# EAGLE design M452X3 (EAGLE 6.6.0)
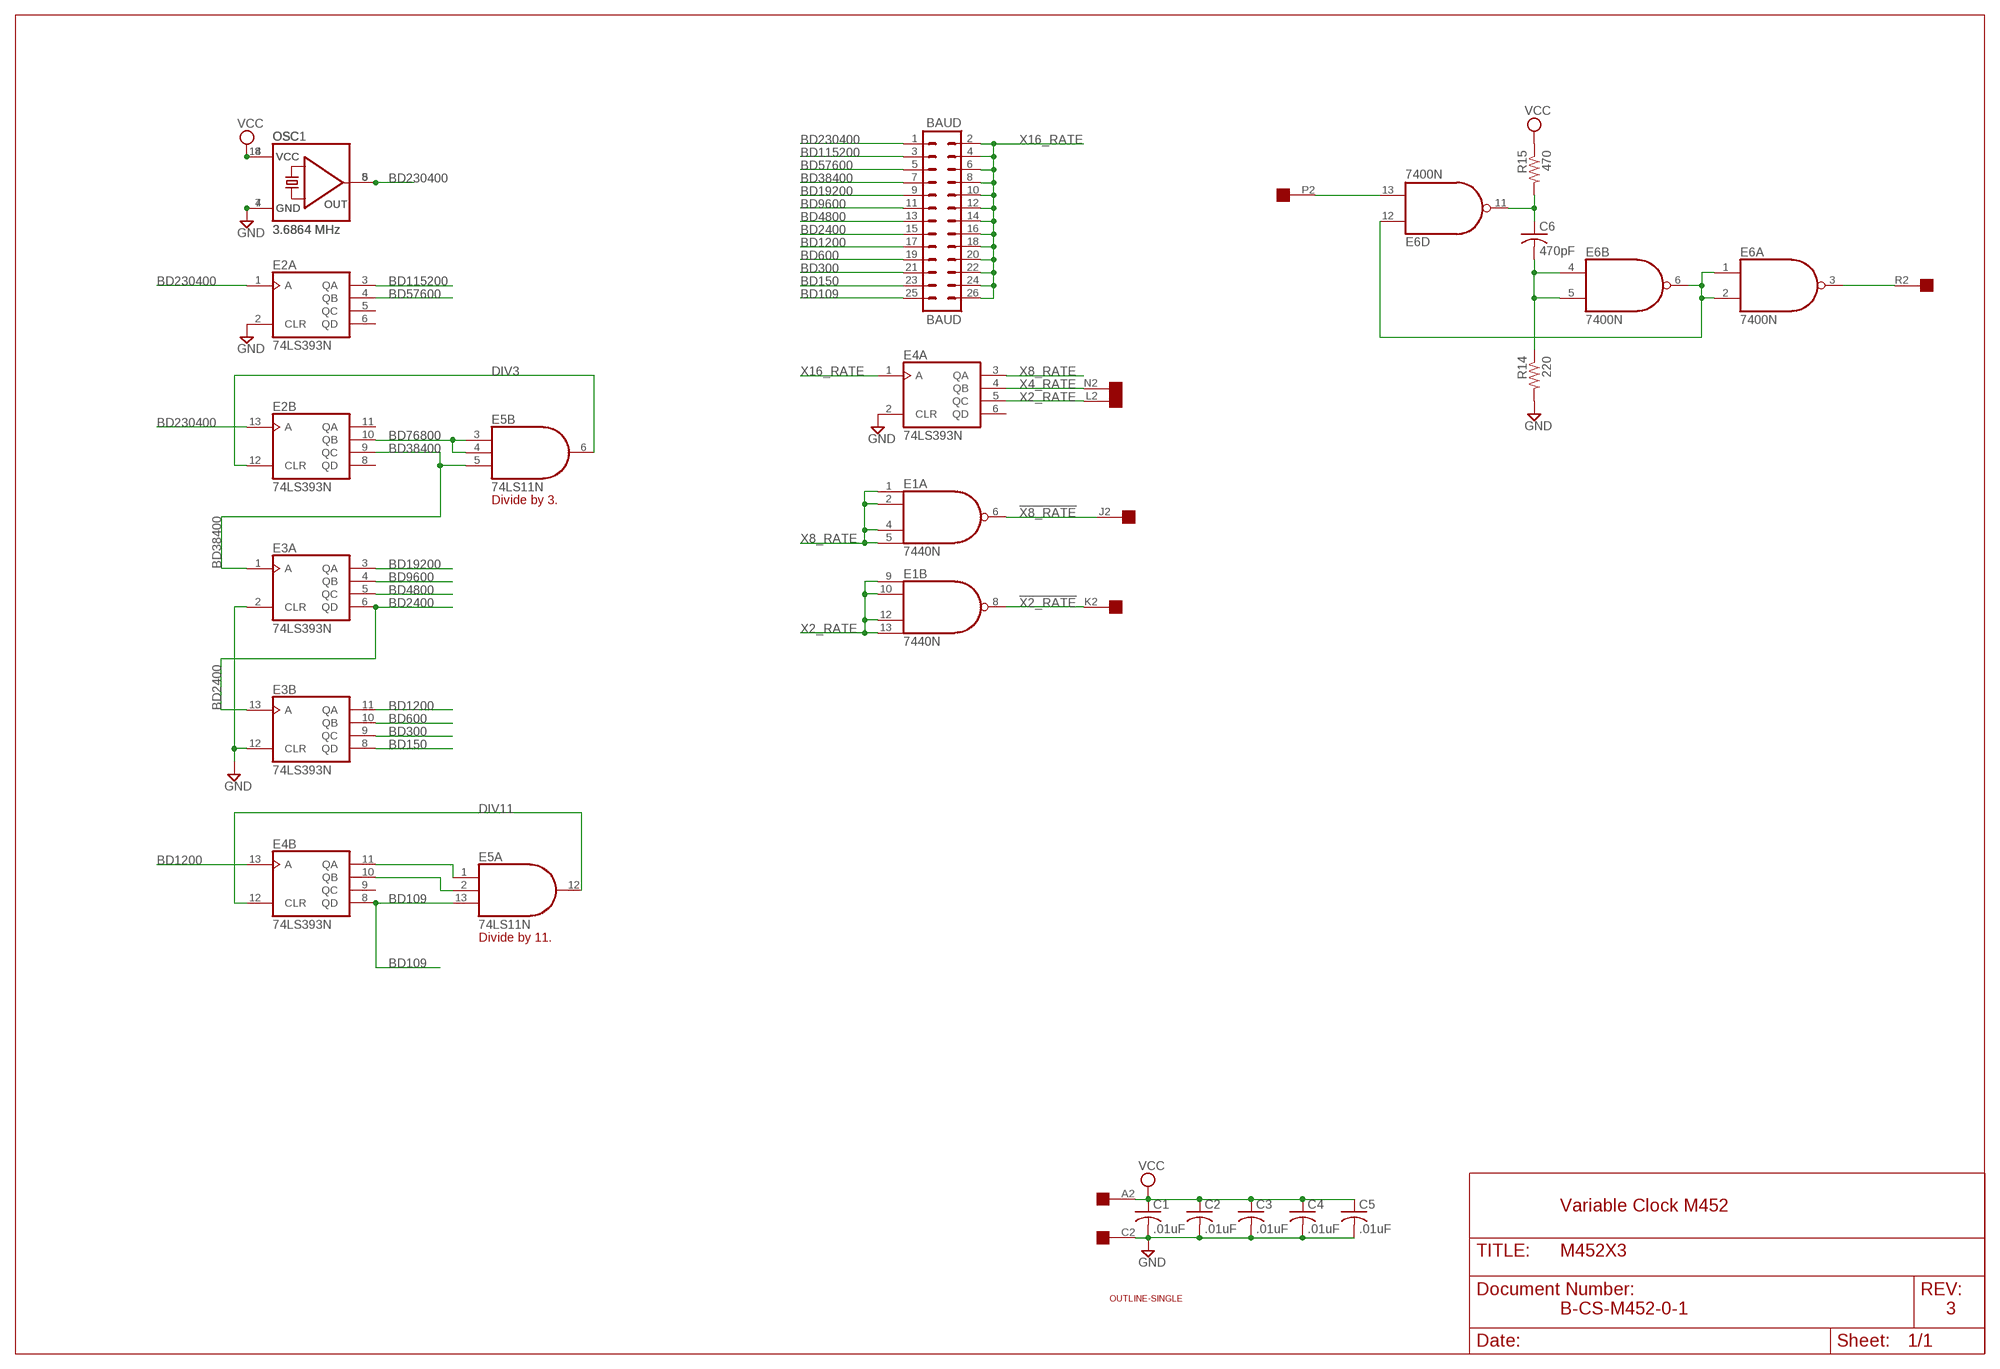
[diagram p0: schematic, sheet 1]

## Parts
BAUD  BAUD  MA13-2  [MA13-2]
C1  .01uF  C-US050-025X075  [C050-025X075]
C2  .01uF  C-US050-025X075  [C050-025X075]
C3  .01uF  C-US050-025X075  [C050-025X075]
C4  .01uF  C-US050-025X075  [C050-025X075]
C5  .01uF  C-US050-025X075  [C050-025X075]
C6  470pF  C-US075-032X103  [C075-032X103]
E1  7440N  74S20N  [DIL14]
E2  74LS393N  [DIL14]
E3  74LS393N  [DIL14]
E4  74LS393N  [DIL14]
E5  74LS11N  [DIL14]
E6  7400N  74LS00N  [DIL14]
OSC  3.6864 MHz  QG5460  [DIL08S]
OSC1  3.6864 MHz  QG5860  [DIL14S]
R14  220  R-US_0207/10  [0207/10]
R15  470  R-US_0207/10  [0207/10]
U$1  OUTLINE-SINGLE  [SINGLE]
U$2  EDGE-1  [EDGE-CON1]

## Nets
!X2_RATE: E1.8(B:O) U$2.K2
!X8_RATE: E1.6(A:O) U$2.J2
BD109: BAUD.25 E4.8(B:QD) E5.13(A:I2)
BD150: BAUD.23 E3.8(B:QD)
BD300: BAUD.21 E3.9(B:QC)
BD600: BAUD.19 E3.10(B:QB)
BD1200: BAUD.17 E3.11(B:QA) E4.13(B:A)
BD2400: BAUD.15 E3.6(A:QD) E3.13(B:A)
BD4800: BAUD.13 E3.5(A:QC)
BD9600: BAUD.11 E3.4(A:QB)
BD19200: BAUD.9 E3.3(A:QA)
BD38400: BAUD.7 E2.9(B:QC) E3.1(A:A) E5.5(B:I2)
BD57600: BAUD.5 E2.4(A:QB)
BD76800: E2.10(B:QB) E5.3(B:I0) E5.4(B:I1)
BD115200: BAUD.3 E2.3(A:QA)
BD230400: BAUD.1 E2.1(A:A) E2.13(B:A) OSC1.8(OUT) OSC.5(OUT)
DIV3 [Supply]: E2.12(B:CLR) E5.6(B:O)
DIV11: E4.12(B:CLR) E5.12(A:O)
GND [Supply]: C1.2 C2.2 C3.2 C4.2 C5.2 E2.2(A:CLR) E3.2(A:CLR) E3.12(B:CLR) E4.2(A:CLR) OSC1.7(GND) OSC.4(GND) R14.2 U$2.C2
N$12: E6.13(D:I1) U$2.P2
N$14: C6.2 E6.4(B:I0) E6.5(B:I1) R14.1
N$16: C6.1 E6.11(D:O) R15.2
N$17: E6.1(A:I0) E6.2(A:I1) E6.6(B:O) E6.12(D:I0)
N$21: E6.3(A:O) U$2.R2
N$24: E4.11(B:QA) E5.1(A:I0)
N$25: E4.10(B:QB) E5.2(A:I1)
VCC [Supply]: C1.1 C2.1 C3.1 C4.1 C5.1 OSC1.14(VCC) OSC.8(VCC) R15.1 U$2.A2
X2_RATE: E1.9(B:I0) E1.10(B:I1) E1.12(B:I2) E1.13(B:I3) E4.5(A:QC) U$2.L2
X4_RATE: E4.4(A:QB) U$2.N2
X8_RATE: E1.1(A:I0) E1.2(A:I1) E1.4(A:I2) E1.5(A:I3) E4.3(A:QA)
X16_RATE: BAUD.2 BAUD.4 BAUD.6 BAUD.8 BAUD.10 BAUD.12 BAUD.14 BAUD.16 BAUD.18 BAUD.20 BAUD.22 BAUD.24 BAUD.26 E4.1(A:A)
Unconnected: E2.5(A:QC) E2.6(A:QD) E2.8(B:QD) E2.11(B:QA) E4.6(A:QD) E4.9(B:QC) E5.8(C:O) E5.9(C:I0) E5.10(C:I1) E5.11(C:I2) E6.8(C:O) E6.9(C:I0) E6.10(C:I1) U$2.B2 U$2.D2 U$2.E2 U$2.F2 U$2.H2 U$2.M2 U$2.S2 U$2.T2 U$2.U2 U$2.V2

## Notes on the sheet
- Divide by 3.
- Divide by 11.
- Variable Clock M452
- B-CS-M452-0-1 | 3

## Power pins joined to a net without a drawn wire
GND: E1.7(P:GND) E2.7(P:GND) E3.7(P:GND) E4.7(P:GND) E5.7(P:GND) E6.7(P:GND)
VCC: E1.14(P:VCC) E2.14(P:VCC) E3.14(P:VCC) E4.14(P:VCC) E5.14(P:VCC) E6.14(P:VCC)

## Library data of the parts
BAUD = con-lstb:MA13-2: PIN HEADER; OC_FARNELL: unknown; OC_NEWARK: unknown
C1-C6 = rcl:C-US: CAPACITOR, American symbol
E1 = 74xx-us:74*20: Dual 4-input NAND gate
E2-E4 = 74xx-us:74*393: Dual 4-bit decade and binary COUNTER
E5 = 74xx-us:74*11: Triple 3-input AND gate
E6 = 74xx-us:74*00: Quad 2-input NAND gate
OSC = crystal:QG5460: CRYSTAL RESONATOR; OC_FARNELL: unknown; OC_NEWARK: unknown
OSC1 = crystal:QG5860: CRYSTAL RESONATOR; OC_FARNELL: unknown; OC_NEWARK: unknown
R14 R15 = rcl:R-US_: RESISTOR, American symbol
U$1 = dec-con:OUTLINE-*: Board outlines for DEC boards.
U$2 = dec-con:EDGE-1: Single-Sided DEC Edge Connector -- (side 2)

## Net classes
1 Supply: width 0.813 mm

## Board
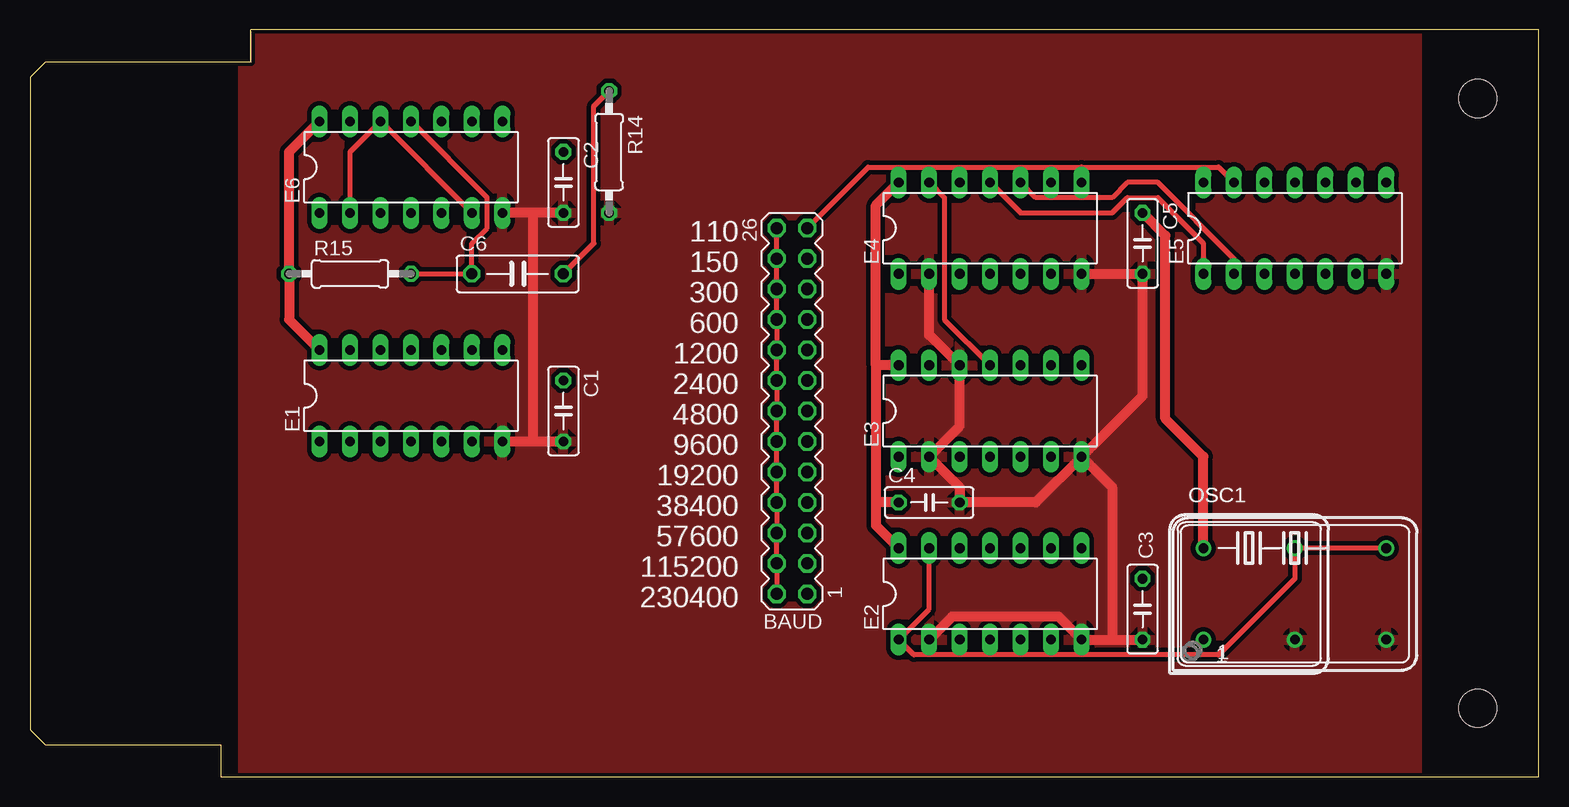
[diagram p1: board, top side]
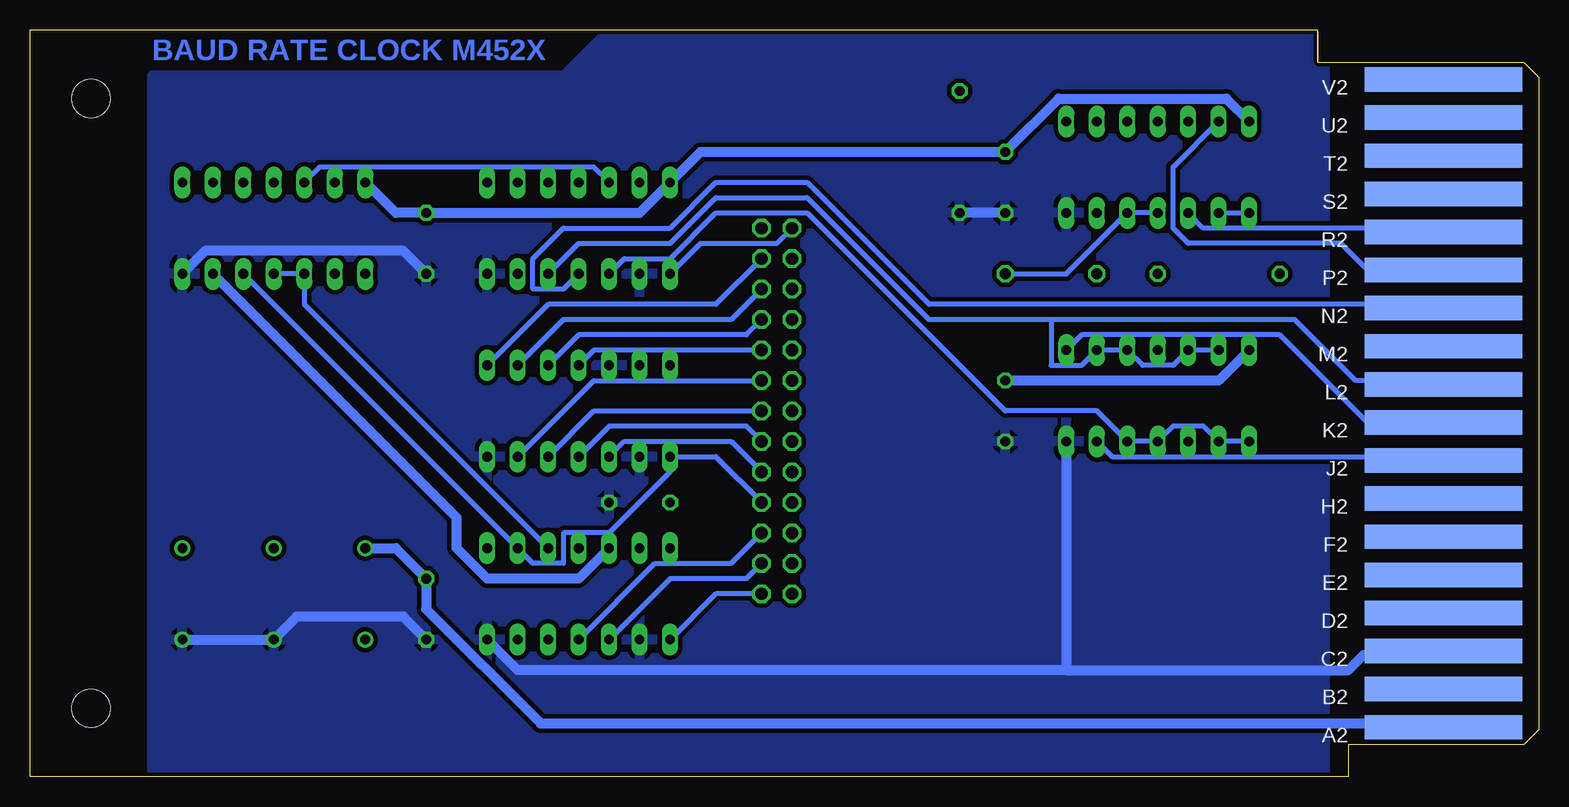
[diagram p2: board, bottom side, seen from below]

Size 125.73 x 62.23 mm. Coordinates in mm from the lower left corner, seen from the top.
Copper layers (1+16): Top 0.035mm / dielectric 1.5mm / Bottom 0.035mm
Design rules "16mils *": minimum track width 16mil, minimum drill 32mil, track to track 15mil, track to pad 10mil, pad to pad 10mil, via to via 10mil, smd to smd 10mil, copper to edge 13mil, drill to drill 10mil, minimum pad ring 10mil, minimum via ring 8mil, stop-mask expansion 0mil, vias tented up to drill 0mil, thermal gap 16mil

### Footprints (pad centres in the part's own frame; a part is rotated, then mirrored left to right if it is on the bottom)
MA13-2 = drill 1.016 octagon: 1 -15.24,-1.27; 2 -15.24,1.27; 3 -12.7,-1.27; 4 -12.7,1.27; 5 -10.16,-1.27; 6 -10.16,1.27; 7 -7.62,-1.27; 8 -7.62,1.27; 9 -5.08,-1.27; 10 -5.08,1.27; 11 -2.54,-1.27; 12 -2.54,1.27; 13 0,-1.27; 14 0,1.27; 15 2.54,-1.27; 16 2.54,1.27; 17 5.08,-1.27; 18 5.08,1.27; 19 7.62,-1.27; 20 7.62,1.27; 21 10.16,-1.27; 22 10.16,1.27; 23 12.7,-1.27; 24 12.7,1.27; 25 15.24,-1.27; 26 15.24,1.27
C050-025X075 = drill 0.813 octagon: 1 -2.54,0; 2 2.54,0
C075-032X103 = drill 0.914 octagon: 1 -3.81,0; 2 3.81,0
DIL14 = drill 0.813 long: 1 -7.62,-3.81; 2 -5.08,-3.81; 3 -2.54,-3.81; 4 0,-3.81; 5 2.54,-3.81; 6 5.08,-3.81; 7 7.62,-3.81; 8 7.62,3.81; 9 5.08,3.81; 10 2.54,3.81; 11 0,3.81; 12 -2.54,3.81; 13 -5.08,3.81; 14 -7.62,3.81
DIL08S = drill 0.813: 1 -3.81,-3.81; 4 3.81,-3.81; 5 3.81,3.81; 8 -3.81,3.81
DIL14S = drill 0.813: 1 -7.62,-3.81; 7 7.62,-3.81; 8 7.62,3.81; 14 -7.62,3.81
0207/10 = drill 0.813 octagon: 1 -5.08,0; 2 5.08,0
SINGLE = hole 3.175: 120.65,56.515; 120.65,5.715
EDGE-CON1 = smd 13.106 x 2.032 bottom: A2 7.938,4.128; B2 7.938,7.303; C2 7.938,10.477; D2 7.938,13.652; E2 7.938,16.828; F2 7.938,20.003; H2 7.938,23.177; J2 7.938,26.352; K2 7.938,29.527; L2 7.938,32.703; M2 7.938,35.877; N2 7.938,39.053; P2 7.938,42.227; R2 7.938,45.403; S2 7.938,48.578; T2 7.938,51.752; U2 7.938,54.928; V2 7.938,58.102

### Placement (x,y rotation side)
BAUD  63.5,30.48 90 top
C1  44.45,30.48 270 top
C2  44.45,49.53 270 top
C3  92.71,13.97 270 top
C4  74.93,22.86 0 top
C5  92.71,44.45 270 top
C6  40.64,41.91 0 top
E1  31.75,31.75 0 top
E2  80.01,15.24 0 top
E3  80.01,30.48 0 top
E4  80.01,45.72 0 top
E5  105.41,45.72 0 top
E6  31.75,50.8 0 top
OSC  101.6,15.24 0 top
OSC1  105.41,15.24 0 top
R14  48.26,52.07 270 top
R15  26.67,41.91 0 top
U$1  0,0 0 top
U$2  0,0 0 top

### Tracks (layer width: path | path; a pad name or v marks a point on that pad's centre or on a via)
!X2_RATE
  Bottom 0.406: E1.8 38.1,36.83 21.59,36.83 13.97,29.21 8.26,29.21 U$2.K2
!X8_RATE
  Bottom 0.406: U$2.J2 10.16,26.67 35.56,26.67 E1.6
BD109
  Top 0.406: 87.63,50.8 69.85,50.8 BAUD.25 | E5.13 99.06,50.8 87.63,50.8 | 87.63,50.8 E4.8
BD150
  Bottom 0.406: E3.8 82.55,39.37 68.58,39.37 BAUD.23
BD300
  Bottom 0.406: E3.9 81.28,38.1 67.31,38.1 BAUD.21
BD600
  Bottom 0.406: E3.10 80.01,36.83 66.04,36.83 BAUD.19
BD1200
  Top 0.406: E4.13 76.2,48.26 76.2,38.1 E3.11
  Bottom 0.406: E3.11 78.74,35.56 BAUD.17
BD2400
  Bottom 0.406: E3.6 78.74,33.02 74.93,33.02 | 74.93,33.02 BAUD.15 | E3.13 74.93,33.02
BD4800
  Bottom 0.406: E3.5 78.74,30.48 BAUD.13
BD9600
  Bottom 0.406: E3.4 77.47,29.21 66.04,29.21 BAUD.11
BD19200
  Bottom 0.406: E3.3 76.2,27.94 67.31,27.94 BAUD.9
BD38400
  Bottom 0.406: E5.5 E2.9 83.82,17.78 81.28,17.78 81.28,20.32 77.47,20.32 72.39,25.4 E3.1 68.58,26.67 BAUD.7
BD57600
  Bottom 0.406: E2.4 73.66,17.78 67.31,17.78 BAUD.5
BD76800
  Bottom 0.406: E5.4 E5.3 102.87,39.37 E2.10
BD115200
  Bottom 0.406: BAUD.3 66.04,16.51 72.39,16.51 E2.3
BD230400
  Top 0.406: OSC1.8 OSC.5 105.41,16.51 99.06,10.16 73.66,10.16 E2.1 74.93,13.97 E2.13
  Bottom 0.406: BAUD.1 68.58,15.24 E2.1
DIV3
  Bottom 0.813: E5.6 90.17,21.59 90.17,19.05 87.63,16.51 80.01,16.51 E2.12
DIV11
  Bottom 0.406: E4.12 78.74,50.8 101.6,50.8 E5.12
GND
  Top 0.813: E4.7 C5.2 92.71,31.75 E3.7 | 90.17,11.43 E2.7 85.73,13.34 76.84,13.34 E2.2 | 90.17,11.43 C3.2 | E1.7 41.91,27.94 | 41.91,27.94 C1.2 | C2.2 41.91,46.99 | 41.91,46.99 E6.7 | 41.91,46.99 41.91,27.94 | E3.7 83.82,22.86 C4.2 77.47,24.13 E3.2 77.47,29.21 E3.12 74.93,36.83 E4.2 | E3.7 90.17,24.13 90.17,11.43
  Bottom 0.813: C3.2 94.62,13.34 103.51,13.34 OSC.4 OSC1.7 | C2.2 R14.2 | 39.37,8.89 15.88,8.89 14.61,10.16 8.26,10.16 U$2.C2 | E1.7 39.37,8.89 | E2.7 85.09,8.89 39.37,8.89 | E5.7 111.13,43.81 94.62,43.81 C5.2
  pour Bottom: 115.57,58.42 115.57,0 17.78,0 17.78,62.23 77.47,62.23 81.28,58.42
  pour Top: 115.57,62.23 115.57,0 17.78,0 17.78,62.23
N$12
  Bottom 0.406: U$2.P2 8.89,42.23 8.89,41.91 13.97,41.91 16.51,44.45 29.21,44.45 30.48,45.72 30.48,50.8 E6.13
N$14
  Top 0.406: R14.1 46.99,55.88 46.99,44.45 C6.2
  Bottom 0.406: E6.4 E6.5 39.37,41.91 C6.2
N$16
  Top 0.406: R15.2 C6.1 36.83,44.45 38.1,45.72 38.1,48.26 E6.11
N$17
  Top 0.406: E6.2 26.67,52.07 E6.12 E6.6
  Bottom 0.406: E6.2 E6.1
N$21
  Bottom 0.406: E6.3 27.94,45.72 8.26,45.72 U$2.R2
N$24
  Top 0.406: E4.11 82.55,46.99 90.17,46.99 91.44,48.26 93.98,48.26 97.79,44.45 E5.1
N$25
  Top 0.406: E5.2 100.33,43.18 93.98,49.53 91.44,49.53 90.17,48.26 83.82,48.26 E4.10
VCC
  Top 0.813: E1.14 21.59,38.1 R15.1 21.59,52.07 E6.14 | OSC1.14 97.79,26.67 94.62,29.84 94.62,45.09 C5.1 | E2.14 70.49,20.95 70.49,22.86 | 70.49,34.29 70.49,22.86 | C4.1 70.49,22.86 | E3.14 70.49,34.29 | 70.49,34.29 70.49,47.62 E4.14
  Bottom 0.813: C1.1 26.67,33.02 E1.14 | E5.14 95.25,46.99 C5.1 74.93,46.99 E4.14 69.85,52.07 C2.1 40.01,56.52 26.04,56.52 E6.14 | OSC1.14 95.25,19.05 C3.1 92.71,13.97 83.19,4.45 8.26,4.45 U$2.A2
X2_RATE
  Bottom 0.406: E1.13 E1.12 30.48,34.29 33.02,34.29 E1.10 E1.9 38.1,34.29 40.64,34.29 40.64,38.1 | U$2.L2 8.57,32.7 8.89,33.02 15.24,33.02 20.32,38.1 40.64,38.1 | 40.64,38.1 50.8,38.1 60.96,48.26 68.58,48.26 72.39,44.45 80.01,44.45 E4.5
X4_RATE
  Bottom 0.406: U$2.N2 8.57,39.05 8.89,39.37 50.8,39.37 60.96,49.53 68.58,49.53 72.39,45.72 81.28,45.72 83.82,43.18 83.82,40.64 81.28,40.64 E4.4
X8_RATE
  Bottom 0.406: E1.1 E1.2 27.94,29.21 30.48,29.21 E1.4 E1.5 36.83,30.48 44.45,30.48 60.96,46.99 68.58,46.99 72.39,43.18 76.2,43.18 E4.3
X16_RATE
  Top 0.406: BAUD.26 BAUD.24 BAUD.22 BAUD.20 BAUD.18 BAUD.16 BAUD.14 BAUD.12 BAUD.10 BAUD.8 BAUD.6 BAUD.4 BAUD.2
  Bottom 0.406: E4.1 69.85,44.45 63.5,44.45 BAUD.26

### Text on the board
Bottom: BAUD RATE CLOCK M452X
tNames: 110 | 150 | 300 | 600 | 1200 | 2400 | 4800 | 9600 | 19200 | 38400 | 57600 | 115200 | 230400